# Altium schematic sheet Power.SchDoc
size A4; PageSetup: Record=PageOptions|CenterHorizontal=True|CenterVertical=True|PrintScale=1.22|XCorrection=1.00|YCorrection=1.00|PrintKind=2|BorderSize=5000000|LeftOffset=0|BottomOffset=0|Orientation=2|PaperLength=1000|PaperWidth=1000|Scale=100|PaperSource=7|PrintQuality=-4|MediaType=1|DitherType=10|PaperKind=A4|PrintScaleMode=1
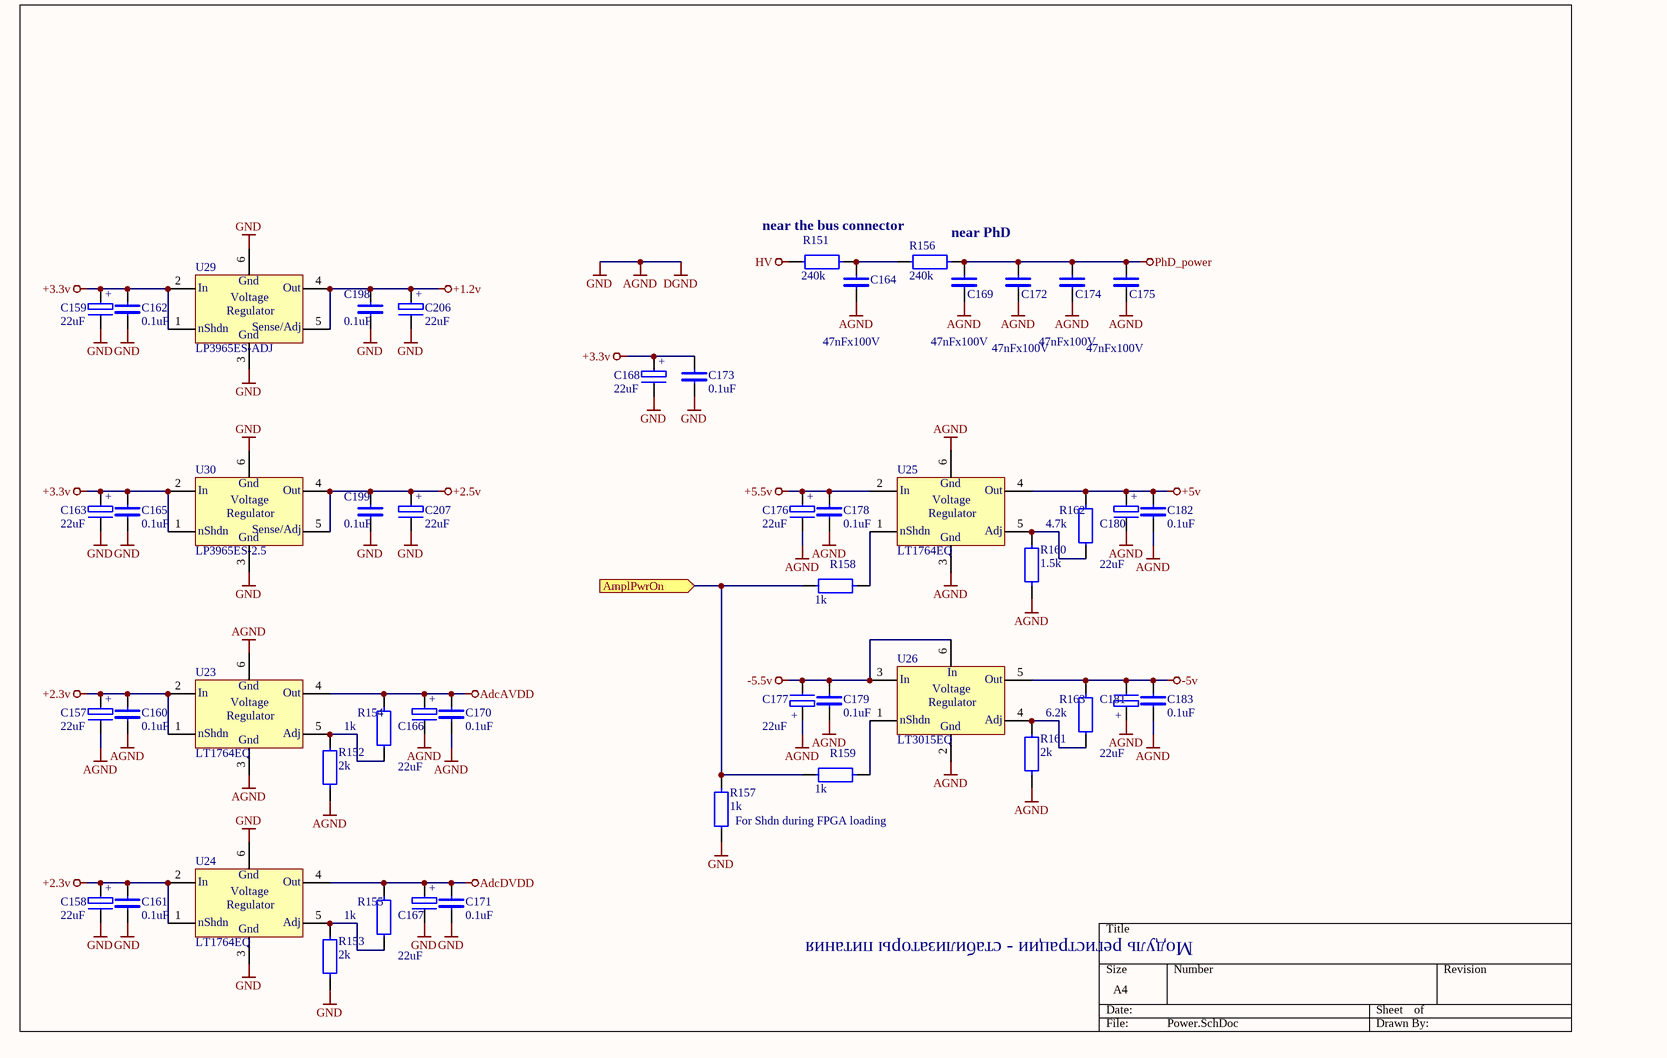
[diagram p0: Power.SchDoc]

## Parts
C157  22uF  [CP6032]
C158  22uF  [CP6032]
C159  22uF  [CP6032]
C160  0.1uF  [0603]
C161  0.1uF  [0603]
C162  0.1uF  [0603]
C163  22uF  [CP6032]
C164  47nFx100V  [1206]
C165  0.1uF  [0603]
C166  22uF  [CP6032]
C167  22uF  [CP6032]
C168  22uF  [CP6032]
C169  47nFx100V  [1206]
C170  0.1uF  [0603]
C171  0.1uF  [0603]
C172  47nFx100V  [1206]
C173  0.1uF  [0603]
C174  47nFx100V  [1206]
C175  47nFx100V  [1206]
C176  22uF  [CP6032]
C177  22uF  [CP6032]
C178  0.1uF  [0603]
C179  0.1uF  [0603]
C180  22uF  [CP6032]
C181  22uF  [CP6032]
C182  0.1uF  [0603]
C183  0.1uF  [0603]
C198  0.1uF  [0603]
C199  0.1uF  [0603]
C206  22uF  [CP6032]
C207  22uF  [CP6032]
R151  240k  [0805]
R152  2k  [0603]
R153  2k  [0603]
R154  1k  [0603]
R155  1k  [0603]
R156  240k  [0805]
R157  1k  [0603]
R158  1k  [0603]
R159  1k  [0603]
R160  1.5k  [0603]
R161  2k  [0603]
R162  4.7k  [0805]
R163  6.2k  [0805]
U23  LT1764EQ  [TO-263-5]
U24  LT1764EQ  [TO-263-5]
U25  LT1764EQ  [TO-263-5]
U26  LT3015EQ  [TO-263-5]
U29  LP3965ES-ADJ  [TO-263-5]
U30  LP3965ES-2.5  [TO-263-5]

## Ports
AmplPwrOn (in)

## Nets
+1.2v: C198.2 C206.+ U29.4(Out) U29.5(SENSE/ADJ)
+2.3v: C157.+ C158.+ C160.2 C161.2 U23.1(nSHDN) U23.2(In) U24.1(nSHDN) U24.2(In)
+2.5v: C199.2 C207.+ U30.4(Out) U30.5(SENSE/ADJ)
+3.3v: C159.+ C162.2 C163.+ C165.2 C168.+ C173.2 U29.1(nSHDN) U29.2(In) U30.1(nSHDN) U30.2(In)
+5.5v: C176.+ C178.2 U25.2(In)
+5v: C180.+ C182.2 R162.2 U25.4(Out)
-5.5v: C177.- C179.2 U26.3(In) U26.6(Substrate)
-5v: C181.- C183.2 R163.2 U26.5(Out)
AdcAVDD: C166.+ C170.2 R154.2 U23.4(Out)
AdcDVDD: C167.+ C171.2 R155.2 U24.4(Out)
AGND: C157.- C158.- C159.- C160.1 C161.1 C162.1 C163.- C164.1 C165.1 C166.- C167.- C168.- C169.1 C170.1 C171.1 C172.1 C173.1 C174.1 C175.1 C176.- C177.+ C178.1 C179.1 C180.- C181.+ C182.1 C183.1 C198.1 C199.1 C206.- C207.- R152.2 R153.2 R157.1 R160.2 R161.2 U23.3(GND) U23.6(Substrate) U24.3(GND) U24.6(Substrate) U25.3(GND) U25.6(Substrate) U26.2(GND) U29.3(GND) U29.6(Substrate) U30.3(GND) U30.6(Substrate)  [also labelled DGND, GND]
HV: R151.1
PhD_power: C169.2 C172.2 C174.2 C175.2 R156.2
AmplPwrOn: R157.2 R158.1 R159.1 ; port AmplPwrOn
NetC164_2: C164.2 R151.2 R156.1
NetR152_1: R152.1 R154.1 U23.5(SENSE/ADJ)
NetR153_1: R153.1 R155.1 U24.5(SENSE/ADJ)
NetR158_2: R158.2 U25.1(nSHDN)
NetR159_2: R159.2 U26.1(nSHDN)
NetR160_1: R160.1 R162.1 U25.5(SENSE/ADJ)
NetR161_1: R161.1 R163.1 U26.4(SENSE/ADJ)

## Notes on the sheet
- near the bus connector
- near PhD
- (near R157) For Shdn during FPGA loading
- Модуль регистрации - стабилизаторы питания
- (in symbol LP3965) Gnd; Voltage; Regulator; nShdn; Sense/Adj
- (in symbol LT1764) Gnd; Voltage; Regulator; nShdn; Adj
- (in symbol LT3015) Voltage; Regulator; nShdn; Adj; Gnd

## Library data of the parts
C157-C159 C163 C166-C168 C176 C177 C180 C181 C206 C207 = C POL
C160-C162 C164 C165 C169-C175 C178 C179 C182 C183 C198 C199 = C
R151-R163 = R
U23-U25 = LT1764: Positive Linear Regulators with On/Off
U26 = LT3015: Negative Linear Regulators with On/Off
U29 U30 = LP3965: Positive Linear Regulators with On/Off